# EAGLE schematic Lens Calibration (EAGLE 9.6.2)
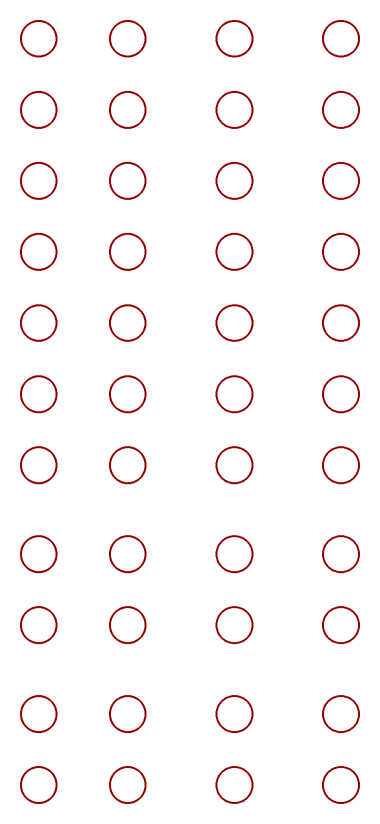
[diagram p0: schematic, sheet 1]

## Parts
U$1  FIDUCIAL  [FIDUCIAL_1MM]
U$2  FIDUCIAL  [FIDUCIAL_1MM]
U$3  FIDUCIAL  [FIDUCIAL_1MM]
U$4  FIDUCIAL  [FIDUCIAL_1MM]
U$5  FIDUCIAL  [FIDUCIAL_1MM]
U$6  FIDUCIAL  [FIDUCIAL_1MM]
U$7  FIDUCIAL  [FIDUCIAL_1MM]
U$8  FIDUCIAL  [FIDUCIAL_1MM]
U$9  FIDUCIAL  [FIDUCIAL_1MM]
U$10  FIDUCIAL  [FIDUCIAL_1MM]
U$11  FIDUCIAL  [FIDUCIAL_1MM]
U$12  FIDUCIAL  [FIDUCIAL_1MM]
U$13  FIDUCIAL  [FIDUCIAL_1MM]
U$14  FIDUCIAL  [FIDUCIAL_1MM]
U$15  FIDUCIAL  [FIDUCIAL_1MM]
U$16  FIDUCIAL  [FIDUCIAL_1MM]
U$17  FIDUCIAL  [FIDUCIAL_1MM]
U$18  FIDUCIAL  [FIDUCIAL_1MM]
U$19  FIDUCIAL  [FIDUCIAL_1MM]
U$20  FIDUCIAL  [FIDUCIAL_1MM]
U$21  FIDUCIAL  [FIDUCIAL_1MM]
U$22  FIDUCIAL  [FIDUCIAL_1MM]
U$23  FIDUCIAL  [FIDUCIAL_1MM]
U$24  FIDUCIAL  [FIDUCIAL_1MM]
U$25  FIDUCIAL  [FIDUCIAL_1MM]
U$26  FIDUCIAL  [FIDUCIAL_1MM]
U$27  FIDUCIAL  [FIDUCIAL_1MM]
U$28  FIDUCIAL  [FIDUCIAL_1MM]
U$29  FIDUCIAL  [FIDUCIAL_1MM]
U$30  FIDUCIAL  [FIDUCIAL_1MM]
U$31  FIDUCIAL  [FIDUCIAL_1MM]
U$32  FIDUCIAL  [FIDUCIAL_1MM]
U$33  FIDUCIAL  [FIDUCIAL_1MM]
U$34  FIDUCIAL  [FIDUCIAL_1MM]
U$35  FIDUCIAL  [FIDUCIAL_1MM]
U$36  FIDUCIAL  [FIDUCIAL_1MM]
U$37  FIDUCIAL  [FIDUCIAL_1MM]
U$38  FIDUCIAL  [FIDUCIAL_1MM]
U$39  FIDUCIAL  [FIDUCIAL_1MM]
U$40  FIDUCIAL  [FIDUCIAL_1MM]
U$41  FIDUCIAL  [FIDUCIAL_1MM]
U$42  FIDUCIAL  [FIDUCIAL_1MM]
U$43  FIDUCIAL  [FIDUCIAL_1MM]
U$44  FIDUCIAL  [FIDUCIAL_1MM]

## Library data of the parts
U$1-U$44 = adafruit:FIDUCIAL: For use by pick and place machines to calibrate the vision/machine, 1mm By microbuilder.eu